# EAGLE design blinkinch (EAGLE 7.5.0)
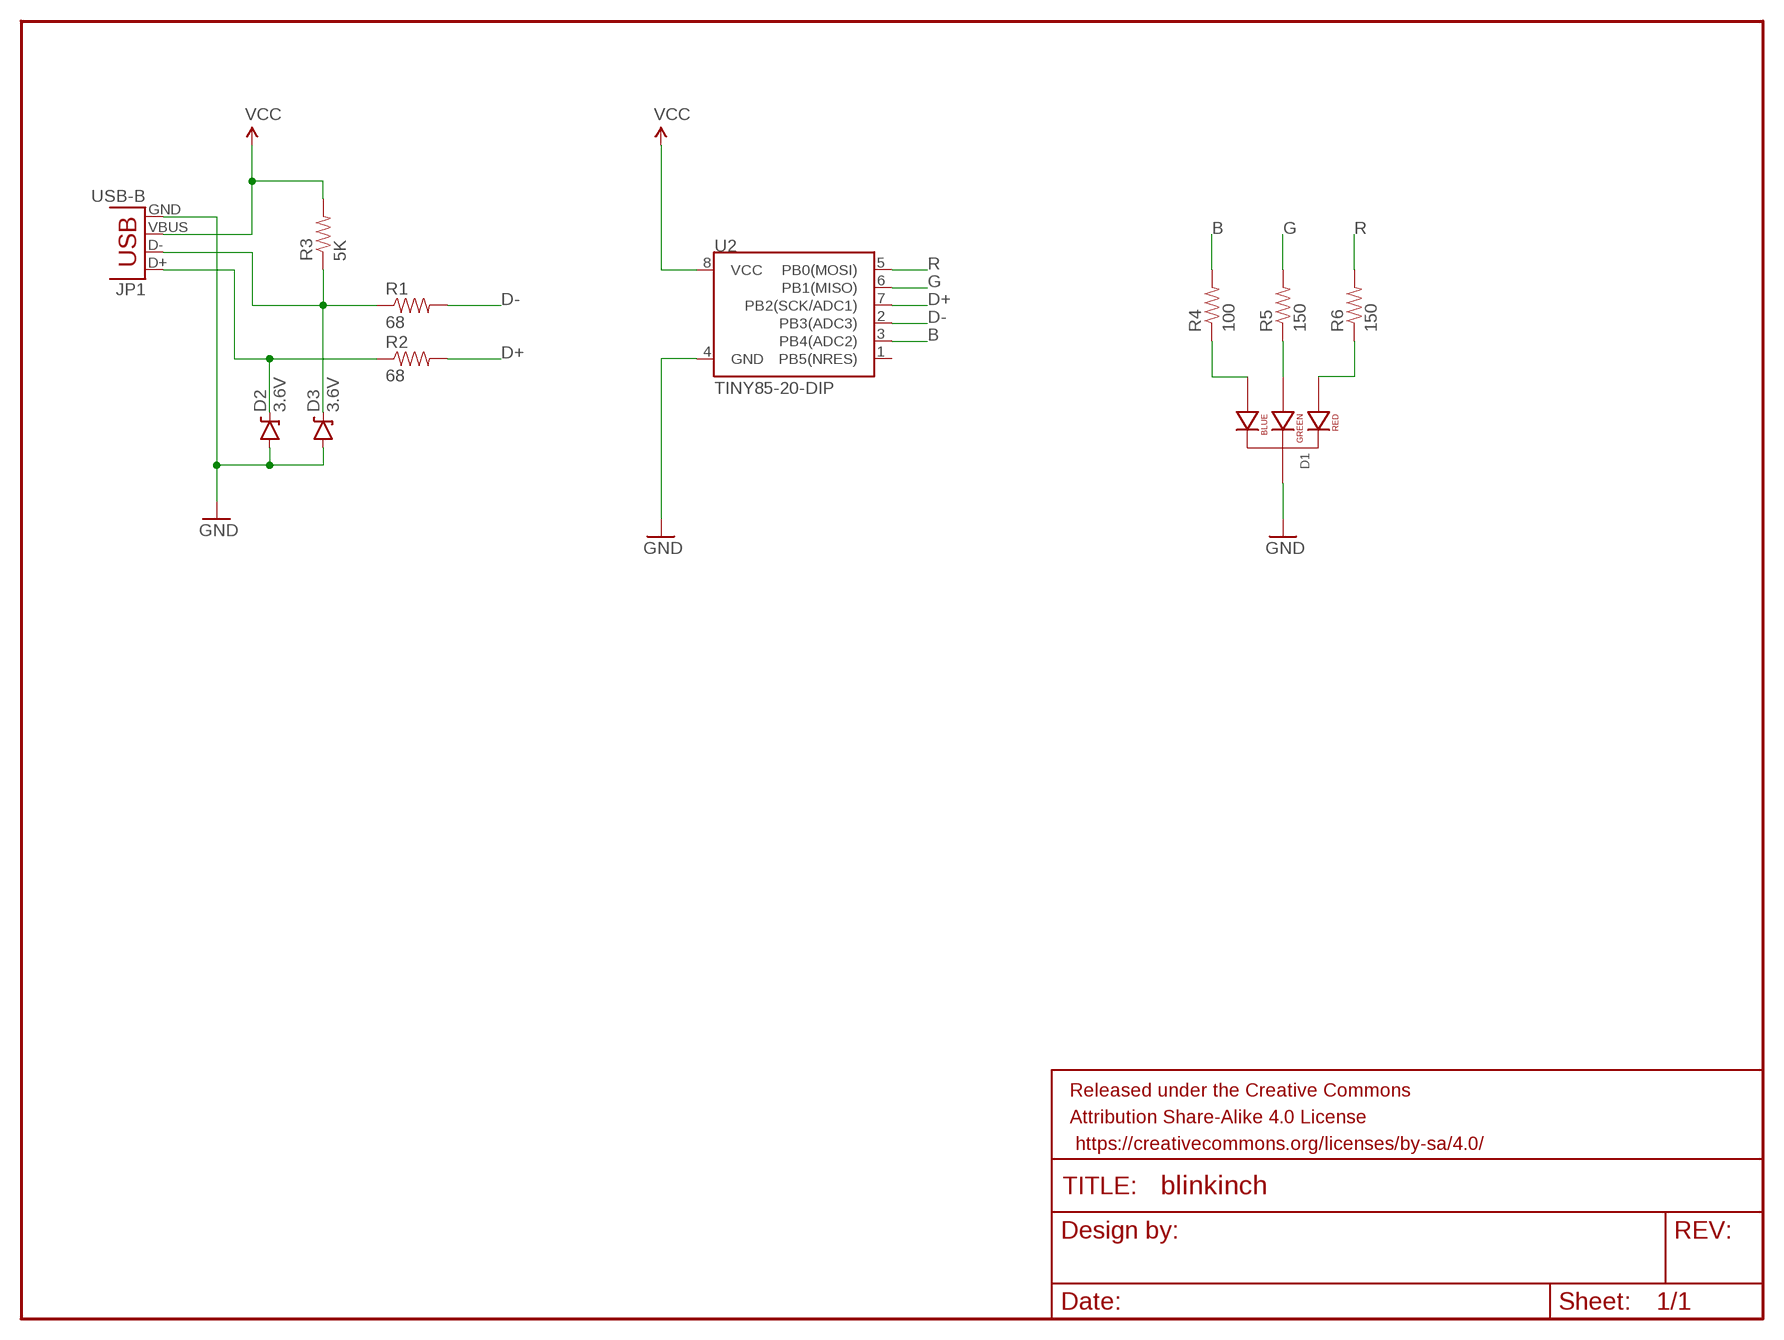
[diagram p0: schematic, sheet 1]

## Parts
D1  LED-RGB-CC-THRUCLEAR  [LED-RGB-THRU]
D2  3.6V  DIODE-ZENERPTH  [DIODE-ZENER]
D3  3.6V  DIODE-ZENERPTH  [DIODE-ZENER]
FRAME1  FRAME-LETTER  [CREATIVE_COMMONS]
JP1  USB-B  USBPTH  [USB-B-PTH]
R1  68  RESISTORPTH-1/4W-VERT  [AXIAL-0.1]
R2  68  RESISTORPTH-1/4W-VERT  [AXIAL-0.1]
R3  5K  RESISTORPTH-1/4W-VERT  [AXIAL-0.1]
R4  100  RESISTORPTH-1/4W-VERT  [AXIAL-0.1]
R5  150  RESISTORPTH-1/4W-VERT  [AXIAL-0.1]
R6  150  RESISTORPTH-1/4W-VERT  [AXIAL-0.1]
U2  TINY85-20-DIP  ATTINY45TINY85-20-DIP  [DIP08]

## Nets
B: R4.P$2 U2.3(PB4(ADC2))
D+: R2.P$2 U2.7(PB2(SCK/ADC1))
D-: R1.P$2 U2.2(PB3(ADC3))
G: R5.P$2 U2.6(PB1(MISO))
GND: D1.2(CATHODE) D2.P$2(A) D3.P$2(A) JP1.GND U2.4(GND)
N$1: D1.4(BLUE_CATHODE) R4.P$1
N$2: D1.3(GREEN_CATHODE) R5.P$1
N$3: D1.1(RED_CATHODE) R6.P$1
N$4: D3.P$1(C) JP1.D- R1.P$1 R3.P$1
N$5: D2.P$1(C) JP1.D+ R2.P$1
R: R6.P$2 U2.5(PB0(MOSI))
VCC: JP1.VBUS R3.P$2 U2.8(VCC)
Unconnected: U2.1(PB5(NRES))

## Library data of the parts
D1 = SparkFun-LED:LED-RGB-CC-THRU: RGB Through-hole common cathode LED SparkFun Storefront: COM-00105 (Clear) COM-09264 (Diffuse); PROD_ID: DIO-08418
D2 D3 = SparkFun-DiscreteSemi:DIODE-ZENER: Zener Diode Production Part - 8199 3.4V Zener Voltage
FRAME1 = SparkFun-Aesthetics:FRAME-LETTER: Schematic Frame Standard 8.5x11 US Letter frame
JP1 = SparkFun-Connectors:USB: USB Connectors USB-B-PTH is fully proven SKU : PRT-00139/CONN-08278 USB-miniB is fully proven SKU : PRT-00587 USB-A-PCB is untested. USB-A-H is throughly reviewed, but untested. Spark Fun Electronics SKU : PRT-00437 USB-B-SMT is throughly reviewed, but untested. Needs silkscreen touching up. USB-A-S has not been used/tested USB-MB-H has not been used/tested USB-MICROB has been used. CONN-09505; PROD_ID: CONN-08278
R1-R6 = SparkFun-Resistors:RESISTOR: Resistor Basic schematic elements and footprints for 0603, 1206, and PTH resistors.
U2 = SparkFun-DigitalIC:ATTINY45: Atmel 8-pin 2/4/8kB flash uC; PROD_ID: IC-09445

## Board
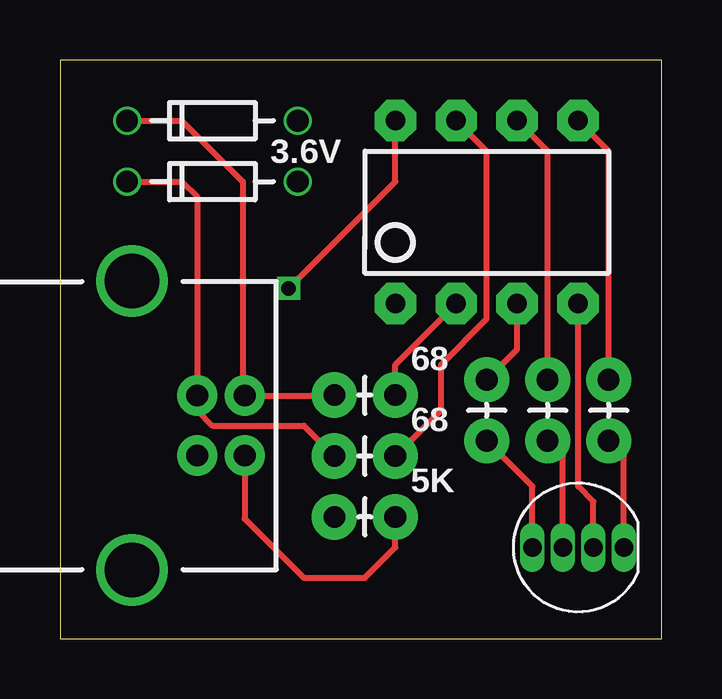
[diagram p1: board, top side]
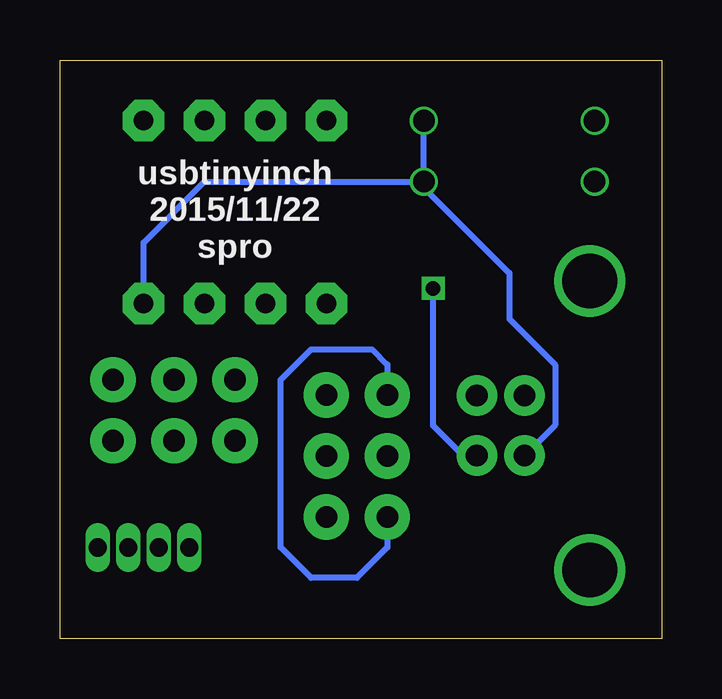
[diagram p2: board, bottom side, seen from below]

Size 25.07 x 24.12 mm. Coordinates in mm from the lower left corner, seen from the top.
Outline: 0,0 25.07,0 25.07,24.12 0,24.12 0,0
Copper layers (1*16): Top 0.0356mm / dielectric 1.5011mm / Bottom 0.0356mm
Design rules "LaenPCBOrder *": minimum track width 6mil, minimum drill 13mil, track to track 6mil, track to pad 6mil, pad to pad 6mil, via to via 6mil, smd to smd 6mil, copper to edge 15mil, drill to drill 6mil, minimum pad ring 5mil, minimum via ring 7mil, stop-mask expansion 3mil, vias tented up to drill 0mil, thermal gap 10mil

### Footprints (pad centres in the part's own frame; a part is rotated, then mirrored left to right if it is on the bottom)
LED-RGB-THRU = drill 0.762 pad 0.813 long: 1 1.905,0; 2 0.635,0; 3 -0.635,0; 4 -1.905,0
DIODE-ZENER = drill 0.9: P$1 -3.556,0; P$2 3.556,0
USB-B-PTH = drill 0.914 pad 1.676: D+ 0,1.25; D- 1.981,1.25; GND 0,-1.25; VBUS 1.981,-1.25 | drill 2.286: S1 -2.718,-6.02; S2 -2.718,6.02
AXIAL-0.1 = drill 0.9 pad 1.88: P$1 0,0; P$2 2.54,0
DIP08 = drill 0.813 pad 1.727 octagon: 1 -3.81,-3.81; 2 -1.27,-3.81; 3 1.27,-3.81; 4 3.81,-3.81; 5 3.81,3.81; 6 1.27,3.81; 7 -1.27,3.81; 8 -3.81,3.81

### Placement (x,y rotation side)
D1  21.59,3.81 0 top
D2  6.35,19.05 0 top
D3  6.35,21.59 0 top
FRAME1  -7.62,27.94 0 top  (outside the outline)
JP1  5.71,8.89 0 top
R1  11.43,10.16 0 top
R2  11.43,7.62 0 top
R3  11.43,5.08 0 top
R4  17.78,8.26 90 top
R5  20.32,8.26 90 top
R6  22.86,8.26 90 top
U2  17.78,17.78 0 top

### Tracks (layer width: path | path; a pad name or v marks a point on that pad's centre or on a via)
B
  Top 0.254: R4.P$2 19.05,12.06 U2.3
D+
  Top 0.254: R2.P$2 15.88,9.53 15.88,11.43 17.78,13.34 17.78,20.32 U2.7
D-
  Top 0.254: R1.P$2 13.97,11.43 U2.2
G
  Top 0.254: R5.P$2 20.32,20.32 U2.6
GND
  Top 0.254: D1.2 22.23,5.71 21.59,6.35 U2.4
  Bottom 0.254: U2.4 21.59,16.51 19.05,19.05 D2.P$2 | D2.P$2 D3.P$2 | D2.P$2 9.91,18.8 6.35,15.24 6.35,13.34 4.45,11.43 4.45,8.91 JP1.GND
N$1
  Top 0.254: D1.4 19.68,6.35 R4.P$1
N$2
  Top 0.254: D1.3 20.95,7.62 R5.P$1
N$3
  Top 0.254: D1.1 23.5,7.62 R6.P$1
N$4
  Top 0.254: D3.P$1 5.08,21.59 7.62,19.05 7.62,10.85 JP1.D- 11.41,10.14 R1.P$1
  Bottom 0.254: R3.P$1 11.43,3.81 12.7,2.54 14.61,2.54 15.88,3.81 15.88,10.79 14.61,12.06 12.06,12.06 11.43,11.43 R1.P$1
N$5
  Top 0.254: D2.P$1 5.08,19.05 5.71,18.41 JP1.D+ 5.71,9.53 6.35,8.89 10.16,8.89 R2.P$1
R
  Top 0.254: R6.P$2 22.86,20.32 U2.5
VCC  (via drill 0.6)
  Top 0.254: JP1.VBUS 7.7,5 10.16,2.54 12.7,2.54 13.97,3.81 R3.P$2 | v9.53,14.61 13.97,19.05 U2.8
  Bottom 0.254: JP1.VBUS 8.28,7.64 9.53,8.89 v9.53,14.61

### Text on the board
bNames: usbtinyinch / 2015/11/22 / spro
tValues: B | G | R